# EAGLE design DMX_Dimmer (EAGLE 5.06)
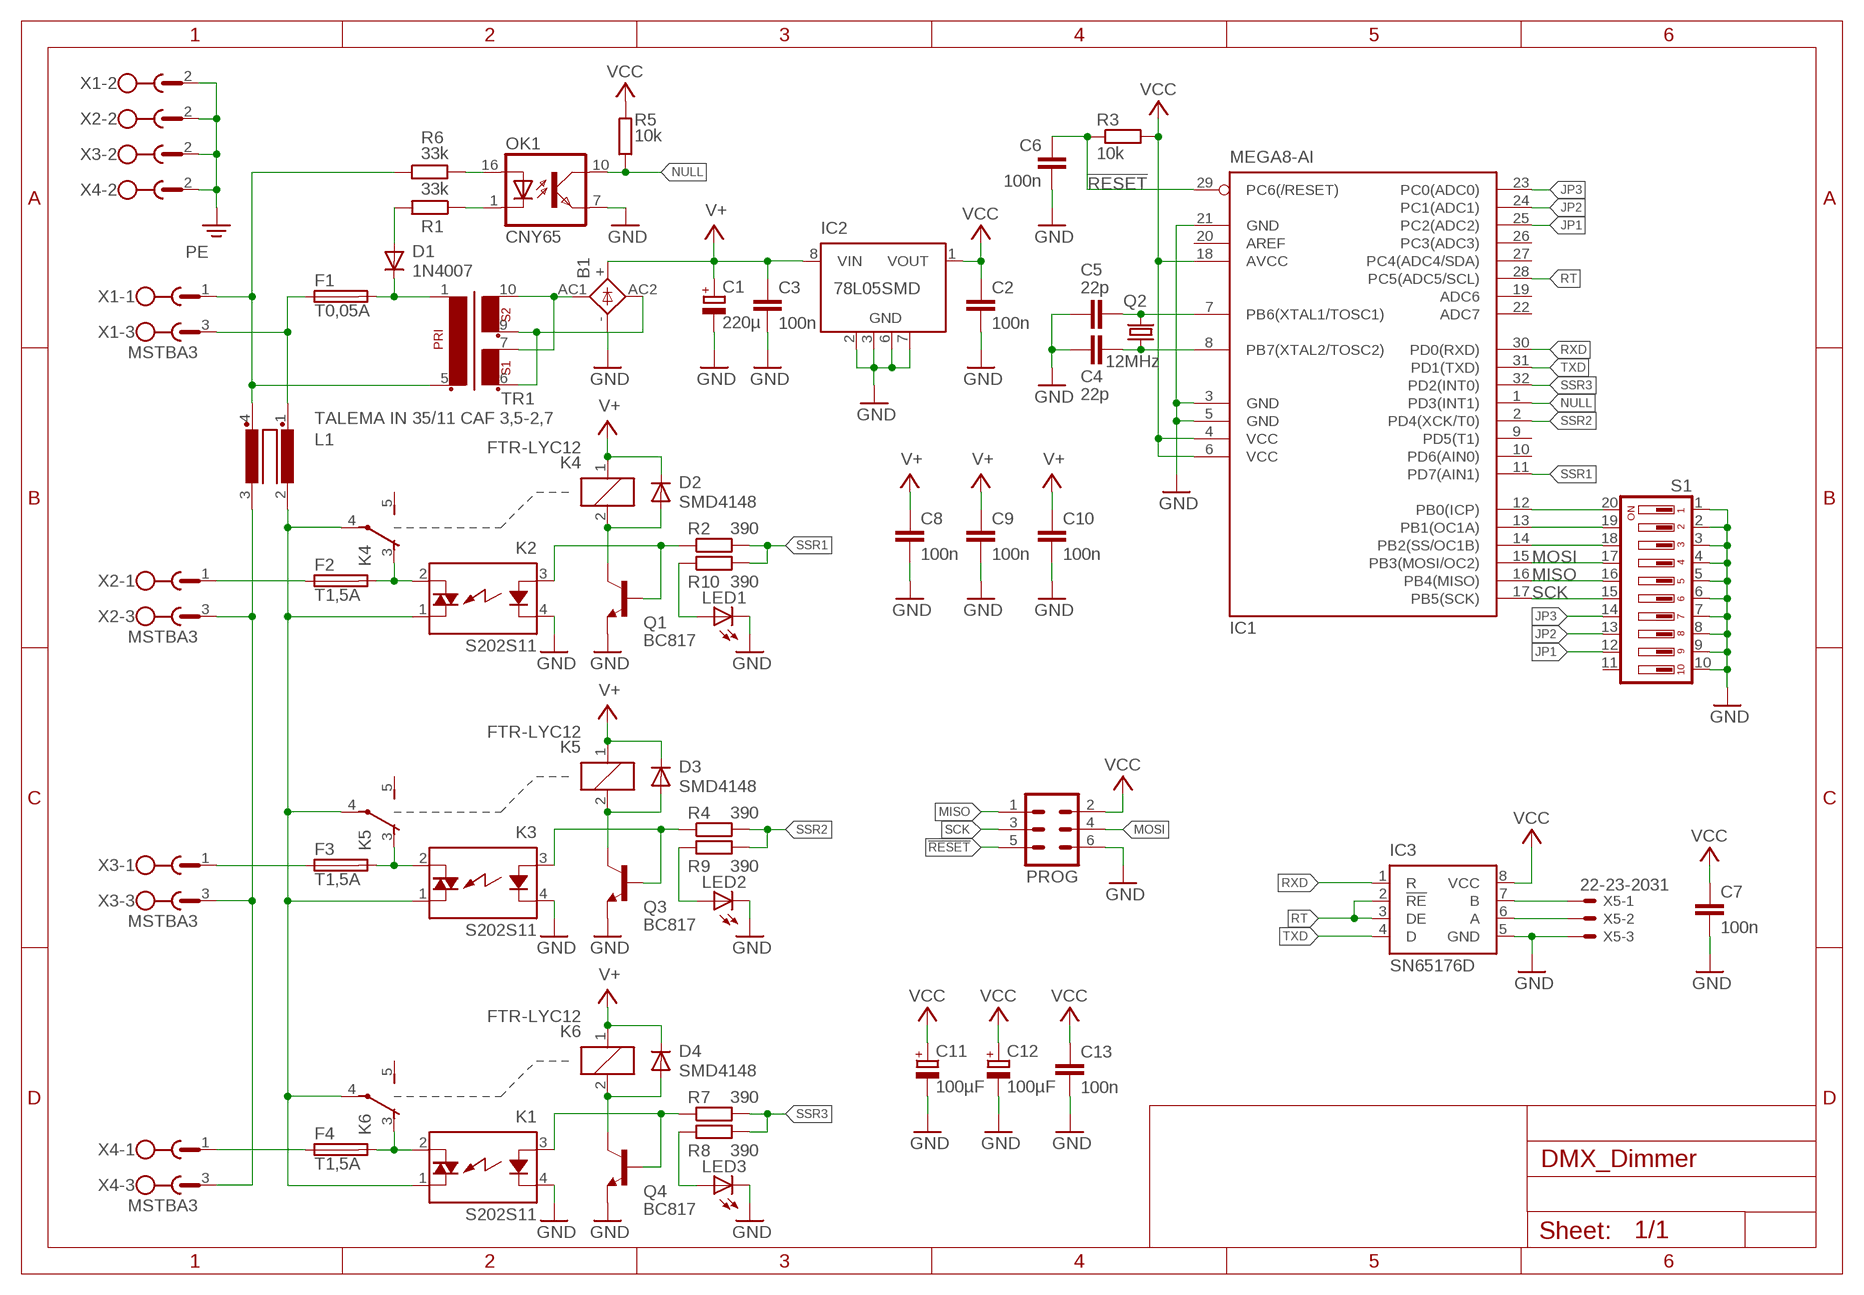
[diagram p0: schematic, sheet 1]

## Parts
B1  2KBB-R  [2KBB-R]
C1  220µ  CPOL-EUE5-8.5  [E5-8,5]
C2  100n  C-EUC0805K  [C0805K]
C3  100n  C-EUC0805K  [C0805K]
C4  22p  C-EUC0805K  [C0805K]
C5  22p  C-EUC0805K  [C0805K]
C6  100n  C-EUC0805K  [C0805K]
C7  100n  C-EUC0805K  [C0805K]
C8  100n  C-EUC0805K  [C0805K]
C9  100n  C-EUC0805K  [C0805K]
C10  100n  C-EUC0805K  [C0805K]
C11  100µF  CPOL-EUSMCD  [SMC_D]
C12  100µF  CPOL-EUSMCD  [SMC_D]
C13  100n  C-EUC0805K  [C0805K]
D1  1N4007  1N4004  [DO41-10]
D2  SMD4148  PMLL4150  [SOD80C]
D3  SMD4148  PMLL4150  [SOD80C]
D4  SMD4148  PMLL4150  [SOD80C]
F1  T0,05A  FUSESH22,5A  [SH22,5A]
F2  T1,5A  FUSESH22,5A  [SH22,5A]
F3  T1,5A  FUSESH22,5A  [SH22,5A]
F4  T1,5A  FUSESH22,5A  [SH22,5A]
IC1  MEGA8-AI  [TQFP32-08]
IC2  78L05SMD  [SO08]
IC3  SN65176D  [SO-08]
K1  S202S11  [S2XXEX]
K2  S202S11  [S2XXEX]
K3  S202S11  [S2XXEX]
K4  FTR-LYC12  [FTR-LYC]
K5  FTR-LYC12  [FTR-LYC]
K6  FTR-LYC12  [FTR-LYC]
L1  TALEMA IN 35/11 CAF 3,5-2,7  82723A  [82723A]
LED1  LEDCHIPLED_1206  [CHIPLED_1206]
LED2  LEDCHIPLED_1206  [CHIPLED_1206]
LED3  LEDCHIPLED_1206  [CHIPLED_1206]
OK1  CNY65  IL10  [DIL16-4_1_7_10_16]
PROG  ML6  [ML6]
Q1  BC817  BC817-16LT1SMD  [SOT23-BEC]
Q2  12MHz  CRYSTALCTS406  [CTS406]
Q3  BC817  BC817-16LT1SMD  [SOT23-BEC]
Q4  BC817  BC817-16LT1SMD  [SOT23-BEC]
R1  33k  R-EU_0207/10  [0207/10]
R2  390  R-EU_M0805  [M0805]
R3  10k  R-EU_R0805  [R0805]
R4  390  R-EU_M0805  [M0805]
R5  10k  R-EU_R0805  [R0805]
R6  33k  R-EU_0207/10  [0207/10]
R7  390  R-EU_M0805  [M0805]
R8  390  R-EU_M0805  [M0805]
R9  390  R-EU_M0805  [M0805]
R10  390  R-EU_M0805  [M0805]
S1  DP10  [DP-10]
TR1  EI30-2  [EI30-2]
X1  MSTBA3  [MSTBA3]
X2  MSTBA3  [MSTBA3]
X3  MSTBA3  [MSTBA3]
X4  MSTBA3  [MSTBA3]
X5  22-23-2031  [22-23-2031]

## Nets
!RESET: C6.1 IC1.29(PC6(/RESET)) PROG.5 R3.1
GND: B1.- C1.- C2.2 C3.2 C4.1 C5.1 C6.2 C7.2 C8.2 C9.2 C10.2 C11.- C12.- C13.2 IC1.3(GND) IC1.5(GND) IC1.21(GND) IC2.2(GND) IC2.3(GND) IC2.6(GND) IC2.7(GND) IC3.5(GND) K1.4(K) K2.4(K) K3.4(K) LED1.C LED2.C LED3.C OK1.7(EMIT) PROG.6 Q1.E Q3.E Q4.E S1.1 S1.2 S1.3 S1.4 S1.5 S1.6 S1.7 S1.8 S1.9 S1.10 X5.3
JP1: IC1.25(PC2(ADC2)) S1.12
JP2: IC1.24(PC1(ADC1)) S1.13
JP3: IC1.23(PC0(ADC0)) S1.14
MISO: IC1.16(PB4(MISO)) PROG.1 S1.16
MOSI: IC1.15(PB3(MOSI/OC2)) PROG.4 S1.17
N$1: D1.A R1.2
N$2: F2.2 K2.2(DS1) K4.3(-1:O)
N$3: LED3.A R8.1
N$4: F3.1 X3.1
N$5: D4.A K6.2 Q4.C
N$9: K1.1(DS2) K2.1(DS2) K3.1(DS2) K4.4(-1:P) K5.4(-1:P) K6.4(-1:P) L1.2
N$10: IC1.12(PB0(ICP)) S1.20
N$11: L1.4 R6.1 TR1.5 X1.1
N$12: F3.2 K3.2(DS1) K5.3(-1:O)
N$13: LED1.A R10.1
N$14: B1.AC1 TR1.7 TR1.10
N$15: F2.1 X2.1
N$16: LED2.A R9.1
N$17: B1.AC2 TR1.6 TR1.9
N$19: IC1.14(PB2(SS/OC1B)) S1.18
N$20: IC1.13(PB1(OC1A)) S1.19
N$21: F1.1 L1.1 X1.3
N$22: C5.2 IC1.7(PB6(XTAL1/TOSC1)) Q2.3
N$23: C4.2 IC1.8(PB7(XTAL2/TOSC2)) Q2.1
N$24: L1.3 X2.3 X3.3 X4.3
N$25: IC3.7(B) X5.1
N$27: IC3.6(A) X5.2
N$28: D1.C F1.2 TR1.1
N$29: D3.A K5.2 Q3.C
N$30: OK1.16(A) R6.2
N$31: K1.3(A) Q4.B R7.1
N$32: OK1.1(C) R1.1
N$33: F4.1 X4.1
N$34: K2.3(A) Q1.B R2.1
N$35: K3.3(A) Q3.B R4.1
N$36: F4.2 K1.2(DS1) K6.3(-1:O)
N$37: D2.A K4.2 Q1.C
NULL: IC1.1(PD3(INT1)) OK1.10(COL) R5.1
PE: X1.2 X2.2 X3.2 X4.2
RT: IC1.28(PC5(ADC5/SCL)) IC3.2(!RE) IC3.3(DE)
RXD: IC1.30(PD0(RXD)) IC3.1(R)
SCK: IC1.17(PB5(SCK)) PROG.3 S1.15
SSR1: IC1.11(PD7(AIN1)) R2.2 R10.2
SSR2: IC1.2(PD4(XCK/T0)) R4.2 R9.2
SSR3: IC1.32(PD2(INT0)) R7.2 R8.2
TXD: IC1.31(PD1(TXD)) IC3.4(D)
V+: B1.+ C1.+ C3.1 C8.1 C9.1 C10.1 D2.C D3.C D4.C IC2.8(VIN) K4.1 K5.1 K6.1
VCC: C2.1 C7.1 C11.+ C12.+ C13.1 IC1.4(VCC) IC1.6(VCC) IC1.18(AVCC) IC2.1(VOUT) IC3.8(VCC) PROG.2 R3.2 R5.2
Unconnected: IC1.9(PD5(T1)) IC1.10(PD6(AIN0)) IC1.19(ADC6) IC1.20(AREF) IC1.22(ADC7) IC1.26(PC3(ADC3)) IC1.27(PC4(ADC4/SDA)) IC2.4(NC) IC2.5(NC) K4.5(-1:S) K5.5(-1:S) K6.5(-1:S) S1.11

## Library data of the parts
B1 = rectifier:2KBB-R: RECTIFIER grid 3 x 5 mm
C1 C11 C12 = rcl:CPOL-EU: POLARIZED CAPACITOR, European symbol
C2-C10 C13 = rcl:C-EU: CAPACITOR, European symbol
D1 = diode:1N4004: DIODE general purpose rectifier, 1 A
D2-D4 = diode:PMLL4150: DIODE high speed
F1-F4 = fuse:FUSE: Fuse; OC_FARNELL: unknown; OC_NEWARK: unknown
IC1 = atmel:MEGA8: MICROCONTROLLER 8 Kbytes FLASH, 1 kbytes SRAM, 512 bytes EEPROM, USART, 6-channel 10 bit ADC, 2-channel 8 bit ADC Pin compatible with Atmega48, ATMega88, ATMega168 Source: avr.lbr
IC2 = linear:78L*SMD: Positive VOLTAGE REGULATOR
IC3 = texas:SN65176: DIFFERENTIAL BUS TRANSCEIVER Source: http://focus.ti.com .. sn65176b.pdf
K1-K3 = relay:S?*: Low Height Type Solid State Relays SHARP Source: 162574-da-01-en-S202T02_Solid_State_Relais.pdf Source: http://sharp-world.com .. s102s11_e.pdf; OC_FARNELL: unknown; OC_NEWARK: unknown
K4-K6 = relay:FTR-LYC: Schmales Netzrelais NETZRELAIS FTR-LYCA024V 1XUM 6A/250VAC Distributor: Conrad electronic Bestell Nr.: 504382 - 62 Source: http://www2.produktinfo.conrad.com/datenblaetter/500000-524999/504382-da-01-de-NETZRELAIS_FTR-LYCA024V_1XUM_6A_250VAC.pdf
L1 = inductors:82723A: FILTER
LED1-LED3 = led:LED: LED OSRAM: - CHIPLED LG R971, LG N971, LY N971, LG Q971, LY Q971, LO R971, LY R971 LH N974, LH R974 LS Q976, LO Q976, LY Q976 LO Q996 - Hyper CHIPLED LW Q18S LB Q993, LB Q99A, LB R99A - SideLED LS A670, LO A670, LY A670, LG A670, LP A670 LB A673, LV A673, LT A673, LW A673 LH A674 LY A675 LS A676, LA A676, LO A676, LY A676, LW A676 LS A679, LY A679, LG A679 - Hyper Micro SIDELED® LS Y876, LA Y876, LO Y876, LY Y876 LT Y87S - SmartLED LW L88C, LW L88S LB L89C, LB L89S, LG L890 LS L89K, LO L89K, LY L89K LS L896, LA L896, LO L896, LY L896 - TOPLED LS T670, LO T670, LY T670, LG T670, LP T670 LSG T670, LSP T670, LSY T670, LOP T670, LYG T670 LG T671, LOG T671, LSG T671 LB T673, LV T673, LT T673, LW T673 LH T674 LS T676, LA T676, LO T676, LY T676, LB T676, LH T676, LSB T676, LW T676 LB T67C, LV T67C, LT T67C, LS T67K, LO T67K, LY T67K, LW E67C LS E67B, LA E67B, LO E67B, LY E67B, LB E67C, LV E67C, LT E67C LW T67C LS T679, LY T679, LG T679 LS T770, LO T770, LY T770, LG T770, LP T770 LB T773, LV T773, LT T773, LW T773 LH T774 LS E675, LA E675, LY E675, LS T675 LS T776, LA T776, LO T776, LY T776, LB T776 LHGB T686 LT T68C, LB T68C - Hyper Mini TOPLED® LB M676 - Mini TOPLED Santana® LG M470 LS M47K, LO M47K, LY M47K Source: http://www.osram.convergy.de LUXEON: - LUMILED® LXK2-PW12-R00, LXK2-PW12-S00, LXK2-PW14-U00, LXK2-PW14-V00 LXK2-PM12-R00, LXK2-PM12-S00, LXK2-PM14-U00 LXK2-PE12-Q00, LXK2-PE12-R00, LXK2-PE12-S00, LXK2-PE14-T00, LXK2-PE14-U00 LXK2-PB12-K00, LXK2-PB12-L00, LXK2-PB12-M00, LXK2-PB14-N00, LXK2-PB14-P00, LXK2-PB14-Q00 LXK2-PR12-L00, LXK2-PR12-M00, LXK2-PR14-Q00, LXK2-PR14-R00 LXK2-PD12-Q00, LXK2-PD12-R00, LXK2-PD12-S00 LXK2-PH12-R00, LXK2-PH12-S00 LXK2-PL12-P00, LXK2-PL12-Q00, LXK2-PL12-R00 Source: www.luxeon.com KINGBRIGHT: KA-3528ASYC Source: www.kingbright.com
OK1 = optocoupler:IL10: SIEMENS OPTO COUPLER; OC_FARNELL: unknown; OC_NEWARK: unknown
PROG = con-harting-ml:ML6: HARTING; OC_FARNELL: unknown; OC_NEWARK: unknown
Q1 Q3 Q4 = transistor-npn:BC817*: NPN Transistor
Q2 = crystal:CRYSTAL: CRYSTAL
R1-R10 = rcl:R-EU_: RESISTOR, European symbol
S1 = switch-dil:DP10: DIL/CODE SWITCH
TR1 = trafo:EI30-2: TRANSFORMER 1 primary winding, 2 secondary windings ERA
X1-X4 = con-phoenix-508:MSTBA3: PHOENIX; MF: FARNELL; MPN: 1757255; OC_FARNELL: 3705183; OC_NEWARK: 71C4162
X5 = con-molex:22-23-2031: .100" (2.54mm) Center Header - 3 Pin; MF: MOLEX; MPN: 22-23-2031; OC_FARNELL: 1462950; OC_NEWARK: 30C0862

## Board
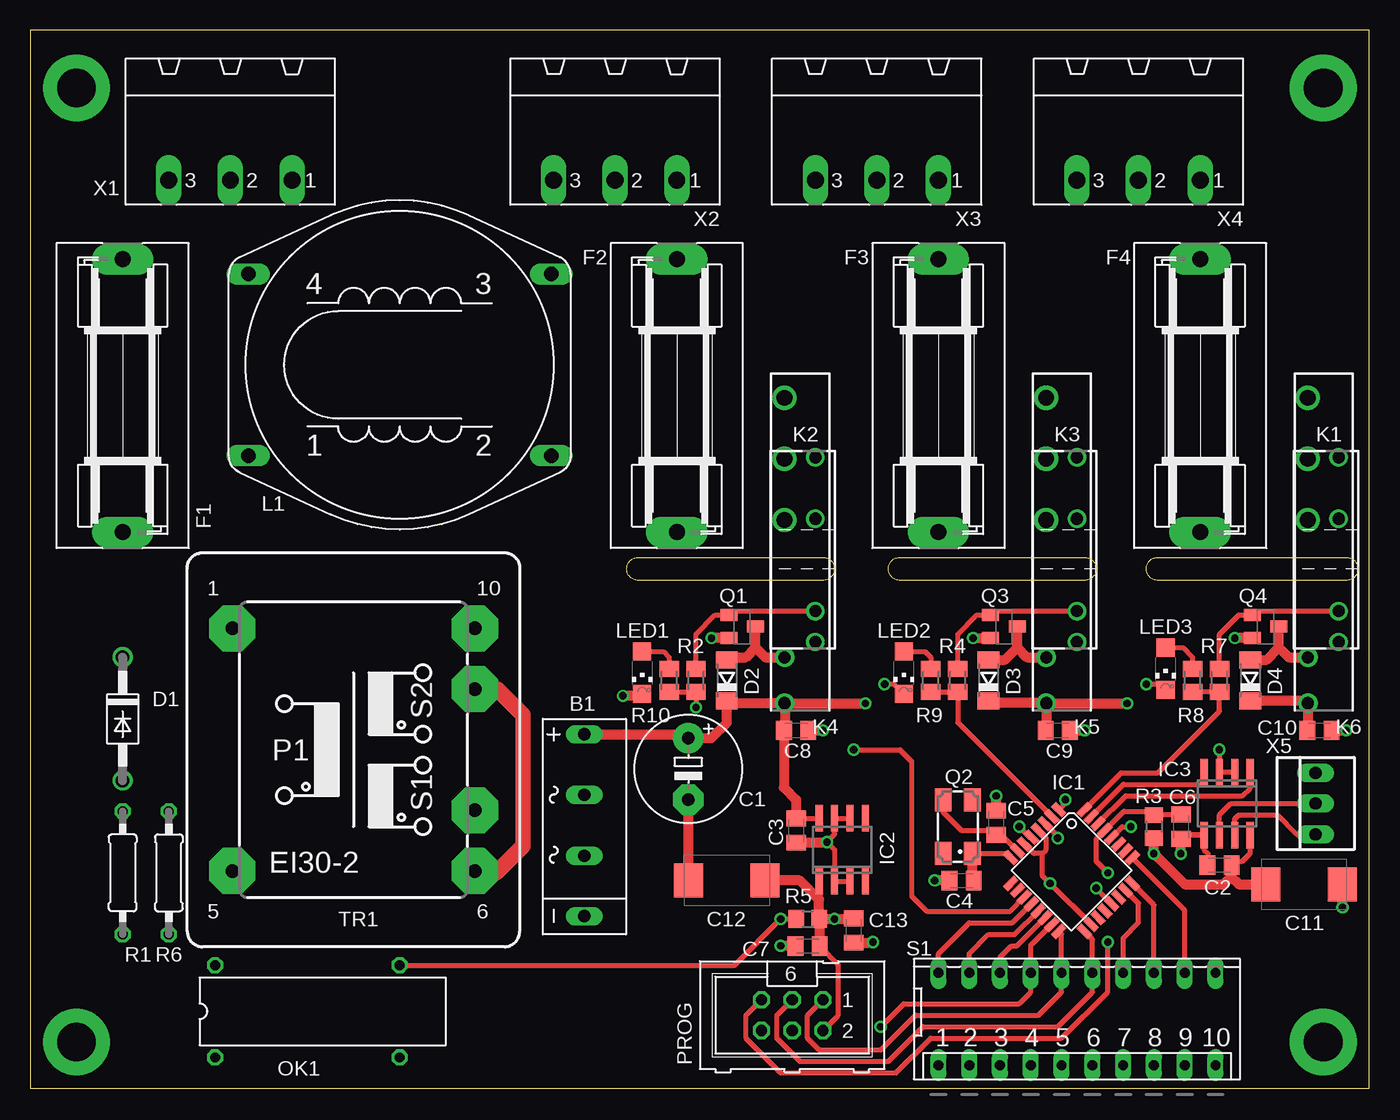
[diagram p1: board, top side]
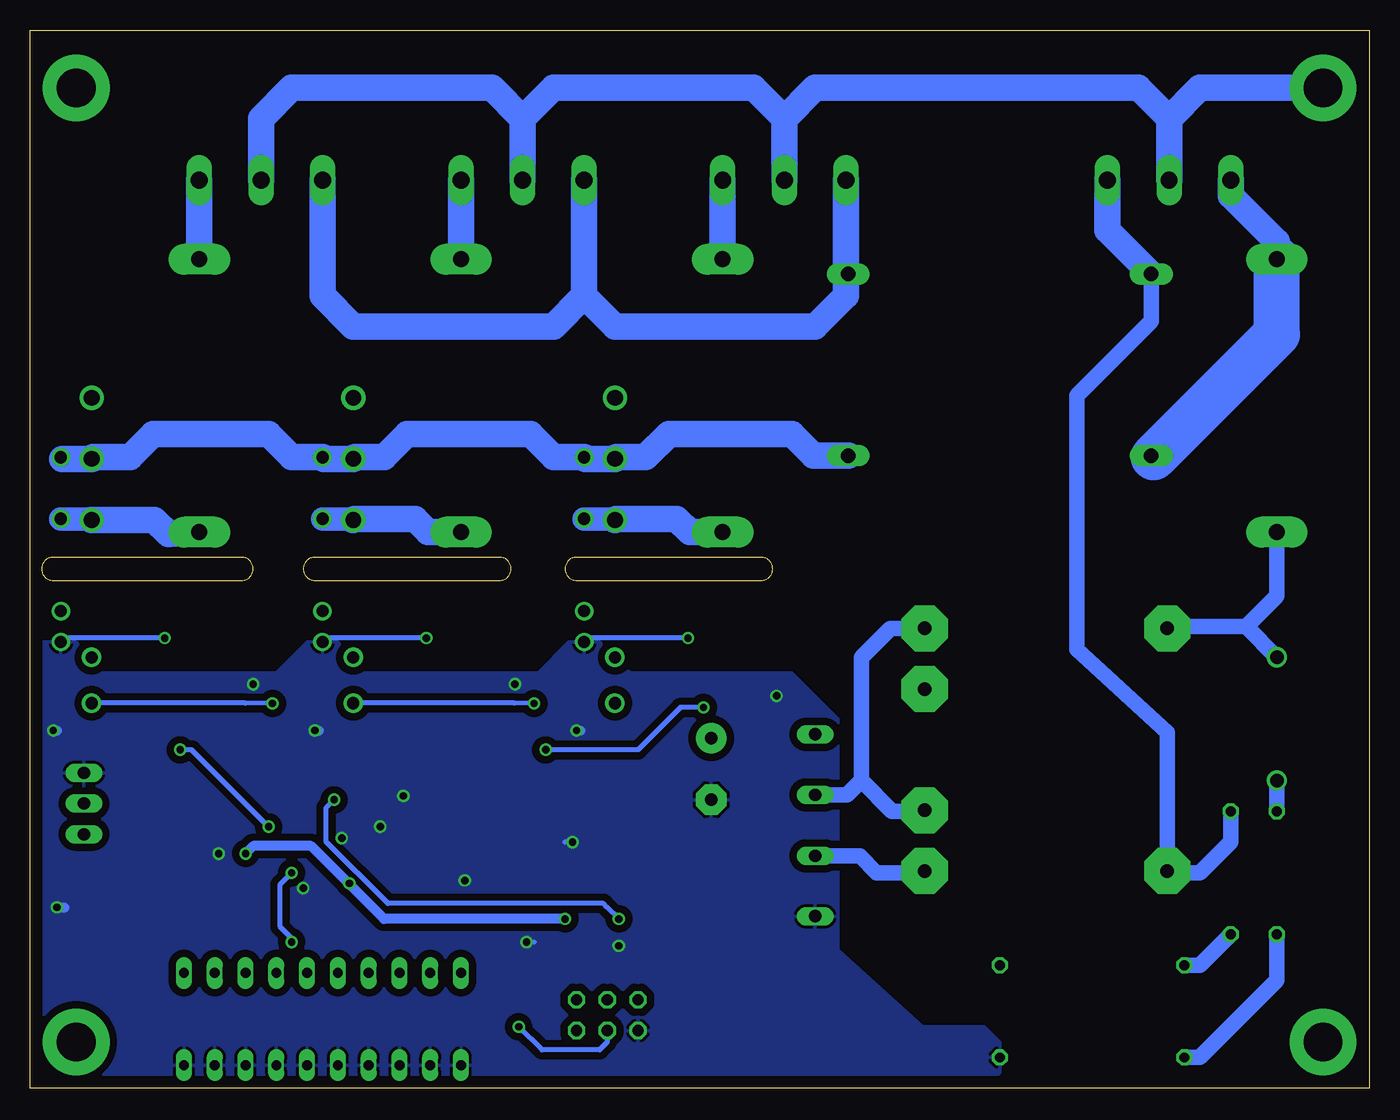
[diagram p2: board, bottom side, seen from below]

Size 110.47 x 87.3 mm. Coordinates in mm from the lower left corner, seen from the top.
Outline: 0,0 110.47,0 110.47,87.3 0,87.3 0,0
Outline: 65.41,41.91 50.16,41.91 arc-180 50.16,43.81 65.41,43.81 arc-180 65.41,41.91
Outline: 87,41.91 71.75,41.91 arc-180 71.75,43.81 87,43.81 arc-180 87,41.91
Outline: 108.58,41.91 93.03,41.91 arc-180 93.03,43.81 108.58,43.81 arc-180 108.58,41.91
Copper layers (1*16): Top 0.035mm / dielectric 1.5mm / Bottom 0.035mm
Design rules "default": minimum track width 10mil, minimum drill 24mil, track to track 8mil, track to pad 8mil, pad to pad 8mil, via to via 8mil, smd to smd 8mil, copper to edge 40mil, drill to drill 8mil, minimum pad ring 10mil, minimum via ring 8mil, stop-mask expansion 4mil, vias tented up to drill 0mil, thermal gap 10mil

### Footprints (pad centres in the part's own frame; a part is rotated, then mirrored left to right if it is on the bottom)
2KBB-R = drill 1.016 long: + -7.62,0; - 7.391,0; AC1 -2.616,0; AC2 2.413,0
E5-8,5 = drill 1.016 pad 2.54 round: + -2.54,0 | drill 1.016 pad 2.54 octagon: - 2.54,0
C0805K = smd 1.3 x 1.6: 1 -1,0; 2 1,0
SMC_D = smd 2.4 x 2.8: + -3.15,0; - 3.15,0
DO41-10 = drill 1.118 round: A 5.08,0; C -5.08,0
SOD80C = smd 1.4 x 1.8: A 1.7,0; C -1.7,0
SH22,5A = drill 1.321 pad 2.54 long: 1 -11.252,0; 2 11.252,0
TQFP32-08 = smd 1.27 x 0.559: 1 -4.293,2.8; 2 -4.293,2; 3 -4.293,1.2; 4 -4.293,0.4; 5 -4.293,-0.4; 6 -4.293,-1.2; 7 -4.293,-2; 8 -4.293,-2.8; 17 4.293,-2.8; 18 4.293,-2; 19 4.293,-1.2; 20 4.293,-0.4; 21 4.293,0.4; 22 4.293,1.2; 23 4.293,2; 24 4.293,2.8 | smd 0.559 x 1.27: 9 -2.8,-4.293; 10 -2,-4.293; 11 -1.2,-4.293; 12 -0.4,-4.293; 13 0.4,-4.293; 14 1.2,-4.293; 15 2,-4.293; 16 2.8,-4.293; 25 2.8,4.293; 26 2,4.293; 27 1.2,4.293; 28 0.4,4.293; 29 -0.4,4.293; 30 -1.2,4.293; 31 -2,4.293; 32 -2.8,4.293
SO08 = smd 0.6 x 2.2: 1 -1.905,-2.6; 2 -0.635,-2.6; 3 0.635,-2.6; 4 1.905,-2.6; 5 1.905,2.6; 6 0.635,2.6; 7 -0.635,2.6; 8 -1.905,2.6
SO-08 = smd 0.6 x 2.2: 1 -1.905,-2.6; 2 -0.635,-2.6; 3 0.635,-2.6; 4 1.905,-2.6; 5 1.905,2.6; 6 0.635,2.6; 7 -0.635,2.6; 8 -1.905,2.6
S2XXEX = drill 1 round: 1 -7.62,0; 2 -2.54,0; 3 5.08,0; 4 7.62,0
FTR-LYC = drill 1 pad 1.6 round: 1 -3.78,0; 2 0,0 | drill 1.3 pad 2 round: 3 11.34,0; 4 16.38,0; 5 21.42,0
82723A = drill 1.194 long: 1 12.497,7.493; 2 -12.497,7.493; 3 -12.497,-7.493; 4 12.497,-7.493
CHIPLED_1206 = smd 1.5 x 1.5: A 0,-1.75; C 0,1.75
DIL16-4_1_7_10_16 = drill 0.813 octagon: 1 -7.62,-3.81; 7 7.62,-3.81; 10 7.62,3.81; 16 -7.62,3.81
ML6 = drill 0.914 octagon: 1 -2.54,-1.27; 2 -2.54,1.27; 3 0,-1.27; 4 0,1.27; 5 2.54,-1.27; 6 2.54,1.27
SOT23-BEC = smd 1 x 1.4: B -0.95,-1.1; C 0,1.1; E 0.95,-1.1
CTS406 = smd 1.9 x 1.4: 1 -2.2,-1.2; 2 2.2,-1.2; 3 2.2,1.2; 4 -2.2,1.2
0207/10 = drill 0.813 octagon: 1 -5.08,0; 2 5.08,0
M0805 = smd 1.3 x 1.6: 1 -0.95,0; 2 0.95,0
R0805 = smd 1.3 x 1.5: 1 -0.95,0; 2 0.95,0
DP-10 = drill 0.813 long: 1 -11.43,-3.81; 2 -8.89,-3.81; 3 -6.35,-3.81; 4 -3.81,-3.81; 5 -1.27,-3.81; 6 1.27,-3.81; 7 3.81,-3.81; 8 6.35,-3.81; 9 8.89,-3.81; 10 11.43,-3.81; 11 11.43,3.81; 12 8.89,3.81; 13 6.35,3.81; 14 3.81,3.81; 15 1.27,3.81; 16 -1.27,3.81; 17 -3.81,3.81; 18 -6.35,3.81; 19 -8.89,3.81; 20 -11.43,3.81
EI30-2 = drill 1.118 pad 3.81 octagon: 1 -10.008,10.008; 5 -10.008,-10.008; 6 10.008,-10.008; 7 10.008,-5.004; 9 10.008,5.004; 10 10.008,10.008
MSTBA3 = drill 1.397 long: 1 -5.08,5.08; 2 0,5.08; 3 5.08,5.08
22-23-2031 = drill 1 long: 1 -2.54,0; 2 0,0; 3 2.54,0

### Placement (x,y rotation side)
B1  45.72,21.59 270 top
C1  54.29,26.35 270 top
C2  98.11,18.41 180 top
C3  63.18,21.27 270 top
C4  76.83,17.14 0 top
C5  79.69,21.91 270 top
C6  94.93,21.59 270 top
C7  64.14,11.75 180 top
C8  63.18,29.53 0 top
C9  84.77,29.53 0 top
C10  106.36,29.53 0 top
C11  105.09,16.83 0 top
C12  57.47,17.14 180 top
C13  67.94,13.02 270 top
D1  7.62,30.48 270 top
D2  57.47,33.66 90 top
D3  79.06,33.66 90 top
D4  100.65,33.66 90 top
F1  7.62,57.15 270 top
F2  53.34,57.15 270 top
F3  74.93,57.15 270 top
F4  96.52,57.15 270 top
IC1  85.91,17.97 315 top
IC2  66.99,19.68 0 top
IC3  98.74,23.5 180 top
K1  107.95,44.45 270 top
K2  64.77,44.45 270 top
K3  86.36,44.45 270 top
K4  62.23,35.56 90 top
K5  83.82,35.56 90 top
K6  105.41,35.56 90 top
L1  30.48,59.69 180 top
LED1  50.48,34.29 180 top
LED2  72.07,34.29 180 top
LED3  93.66,34.61 180 top
OK1  22.86,6.35 0 top
PROG  62.87,6.03 180 top
Q1  58.74,38.1 270 top
Q2  76.52,21.59 90 top
Q3  80.33,38.1 270 top
Q4  101.92,38.1 270 top
R1  7.62,17.78 90 top
R2  54.93,33.66 270 top
R3  92.71,21.59 270 top
R4  76.52,33.66 270 top
R5  64.14,13.97 0 top
R6  11.43,17.78 270 top
R7  98.11,33.66 270 top
R8  95.89,33.66 270 top
R9  74.3,33.66 270 top
R10  52.7,33.66 270 top
S1  86.36,5.71 0 top
TR1  26.67,27.94 0 top
X1  16.51,80.01 180 top
X2  48.26,80.01 180 top
X3  69.85,80.01 180 top
X4  91.44,80.01 180 top
X5  106.05,23.5 90 top

### Tracks (layer width: path | path; a pad name or v marks a point on that pad's centre or on a via)
!RESET  (via drill 0.6)
  Top 0.406: PROG.5 59.05,6.03 59.05,4.13 61.91,1.27 71.44,1.27 74.3,4.13 85.09,4.13 88.9,7.94 v88.9,12.06 | v88.9,17.78 87.95,18.73 87.95,20.57 IC1.29 90.24,22.86 92.39,22.86 R3.1 92.76,22.54 92.81,22.59 C6.1
  Bottom 0.406: v88.9,17.78 89.85,16.83 89.85,13.34 88.9,12.38 v88.9,12.06
GND  (via drill 0.6)
  Top 0.406: v77.79,37.15 | v56.2,37.15 | v99.38,37.15 | IC1.21 88.27,16.18 v87.95,16.51 | IC1.3 84.77,20.8 v84.77,20.64 | C6.2 95.24,20.89 IC3.5 | IC3.5 96.84,19.68 97.16,19.37 97.16,18.68 C2.2 | IC3.5 95.19,20.89 94.93,20.64 | IC1.5 82.47,20.72 v81.6,21.59 | LED1.C 50.48,32.38 | IC2.6 IC2.7 66.36,20.95 v65.72,20.32 | IC2.3 IC2.2 66.36,19.68 v65.72,20.32 | 65.67,20.27 v65.72,20.32 | v70.48,33.34 71.28,33.34 LED2.C | v92.08,33.34 93.18,33.34 LED3.C
  Top 0.813: v77.79,37.15 Q3.E | Q1.E v56.2,37.15 | Q4.E v99.38,37.15 | C4.1 v74.61,17.14 | v94.93,19.37 94.93,20.64 | C7.2 v61.91,11.75 | C5.1 v79.69,24.13 | C10.2 v108.58,29.53 | C9.2 v87,29.53 | C8.2 v65.41,29.53 | 50.48,32.38 v48.9,32.38 | C3.2 65.67,20.27 | C11.- 108.24,14.95 v108.27,14.92 | C1.- 54.29,17.17 C12.- | C13.2 69.17,12.02 v69.53,12.06
  Bottom 0.406: v77.79,37.15 86.04,37.15 K3.4 | v56.2,37.15 64.45,37.15 K2.4 | v99.38,37.15 107.63,37.15 K1.4 | v84.77,20.64 84.77,20.32 | v94.93,19.37 95.25,19.37 | v79.69,24.13 79.38,24.13 | v81.6,21.59 81.6,21.91 | v48.9,32.38 49.21,32.38 | v70.48,33.34 70.8,33.34 | v92.08,33.34 92.39,33.34 | v65.72,20.32 66.36,20.32 | v69.53,12.06 68.9,12.06
  Bottom 0.813: v108.58,29.53 108.27,29.53 | v87,29.53 86.68,29.53 | v65.41,29.53 65.09,29.53 | v108.27,14.92 107.63,14.92
  pour Bottom (isolate 0.61): 43.81,30.48 47.62,34.29 60.96,34.29 63.5,36.83 66.04,36.83 68.58,34.29 83.19,34.29 85.09,36.83 87.63,36.83 90.17,34.29 104.46,34.29 106.68,36.83 110.49,36.83 110.49,0 31.75,0 30.48,1.27 30.48,3.81 31.75,5.08 36.83,5.08 43.81,11.43
JP1
  Top 0.406: IC1.25 95.25,14.7 S1.12
JP2
  Top 0.406: IC1.24 92.71,15.13 S1.13
JP3
  Top 0.406: IC1.23 91.44,15.27 91.44,13.65 90.17,12.38 S1.14
MISO
  Top 0.406: IC1.16 85.09,12.72 S1.16 85.09,7.94 83.19,6.03 73.03,6.03 70.17,3.17 65.09,3.17 64.14,4.13 64.14,6.03 PROG.1
MOSI  (via drill 0.6)
  Top 0.406: IC1.15 82.55,11.78 S1.17 82.55,7.94 81.6,6.99 72.07,6.99 v70.17,5.08
  Bottom 0.406: v70.17,5.08 68.26,3.17 63.5,3.17 62.87,3.81 PROG.4
N$1
  Bottom 1.27: R1.2 D1.A
N$2
  Bottom 1.93: 57.15,46.99 K2.2
  Bottom 2.184: F2.2 56.06,45.9 57.15,46.99 62.14,46.99 K4.3
N$3
  Top 0.406: LED3.A 95.09,36.36 95.89,35.56 R8.1
N$4
  Bottom 2.184: F3.1 X3.1
N$5
  Top 0.813: 103.02,36.37 Q4.C | 103.02,36.37 103.82,35.56 K6.2 | D4.A 102.01,35.35 103.02,36.37
N$6  (via drill 3.2 pad 5.5)
  other vias: 3.81,3.81
N$7  (via drill 3.2 pad 5.5)
  other vias: 106.68,3.81
N$8  (via drill 3.2 pad 5.5)
  other vias: 106.68,82.55
N$9
  Bottom 1.27: 62.1,52.07 K4.4 | 64.64,51.94 K2.1 | 83.69,52.07 K5.4 | 86.23,51.94 K3.1 | 105.28,52.07 K6.4 | 107.82,51.94 K1.1
  Bottom 2.184: L1.2 45.85,52.2 47.62,53.98 57.78,53.98 59.69,52.07 62.1,52.07 | K4.4 64.64,51.94 | K2.1 67.31,52.07 69.22,53.98 79.38,53.98 81.28,52.07 83.69,52.07 | K5.4 86.23,51.94 | K3.1 88.9,52.07 90.81,53.98 100.33,53.98 102.23,52.07 105.28,52.07 | K6.4 107.82,51.94
N$10
  Top 0.406: IC1.12 81.03,13.65 77.47,13.65 74.93,11.11 S1.20
N$11
  Bottom 0.406: 16.51,17.78 TR1.5
  Bottom 1.27: L1.4 17.98,63.3 24.13,57.15 24.13,36.2 16.66,29.36 TR1.5 | R6.1 11.43,20.32 13.97,17.78 16.51,17.78
  Bottom 2.184: X1.1 21.59,70.79 L1.4
N$12
  Bottom 1.93: 78.74,46.99 K3.2
  Bottom 2.184: F3.2 77.65,45.9 78.74,46.99 83.73,46.99 K5.3
N$13
  Top 0.406: LED1.A 52.23,36.04 52.7,35.56 R10.1
N$14
  Bottom 1.27: TR1.10 39.52,37.95 41.91,35.56 41.91,25.4 | 41.91,25.4 39.37,22.86 36.75,22.86 TR1.7 | B1.AC1 43.1,24.21 41.91,25.4
N$15
  Bottom 2.184: F2.1 X2.1
N$16
  Top 0.406: LED2.A 73.81,36.04 74.3,35.56 R9.1
N$17
  Top 0.406: TR1.6 36.83,17.78
  Top 1.27: TR1.9 38.49,32.94 40.64,30.8 40.64,20 38.42,17.78 36.83,17.78
  Bottom 1.27: B1.AC2 42.04,19.18 40.64,17.78 36.83,17.78 TR1.6
N$19
  Top 0.406: IC1.14 81.39,11.75 80.96,11.75 80.01,10.79 S1.18
N$20
  Top 0.406: IC1.13 81.21,12.7 79.06,12.7 77.47,11.11 S1.19
N$21
  Bottom 1.27: 17.78,52.07 17.86,52.07 L1.1
  Bottom 2.184: X1.3 11.43,73.66 7.62,69.85 F1.1
  Bottom 3.81: F1.1 7.62,62.23 17.78,52.07
N$22
  Top 0.406: IC1.7 80.14,20.91 C5.2 79.33,21.27 76.83,21.27 75.32,22.79 Q2.3
N$23
  Top 0.406: C4.2 77.72,17.26 | IC1.8 80.53,19.39 Q2.1
  Top 0.813: 77.72,17.26 Q2.1
N$24
  Bottom 2.184: L1.3 43.18,67.39 X2.3 43.18,65.41 45.72,62.87 62.23,62.87 64.77,65.41 | 64.77,65.41 X3.3 | 64.77,65.41 67.31,62.87 83.82,62.87 86.36,65.41 X4.3
N$25
  Top 0.406: X5.1 104.46,20.95 102.87,22.54 99.69,22.54 99.38,22.23 IC3.7
N$27
  Top 0.406: X5.2 99.06,23.5 98.11,22.54 IC3.6
N$28
  Bottom 1.27: 10.16,38.1 16.51,38.1 TR1.1 | F1.2 7.62,40.64 10.16,38.1 | D1.C 10.16,38.1
N$29
  Top 0.813: 81.43,36.37 Q3.C | 81.43,36.37 82.23,35.56 K5.2 | D3.A 80.42,35.35 81.43,36.37
N$30
  Bottom 1.27: R6.2 13.97,10.16 OK1.16
N$31
  Top 0.406: K1.3 100.82,39.37 Q4.B 99.69,39.05 98.11,37.47 R7.1
N$32
  Bottom 1.27: R1.1 7.62,8.89 13.97,2.54 OK1.1
N$33
  Bottom 2.184: F4.1 X4.1
N$34
  Top 0.406: K2.3 58.27,39.37 Q1.B 56.51,39.05 54.93,37.47 R2.1
N$35
  Top 0.406: K3.3 79.23,39.37 Q3.B 78.1,39.05 78.11,39.05 76.52,37.47 R4.1
N$36
  Bottom 1.93: F4.2 99.24,45.9 100.33,46.99 K1.2
  Bottom 2.184: F4.2 99.06,45.72 100.24,46.9 K6.3
N$37
  Top 0.406: D2.A 58.31,35.56
  Top 0.813: 59.84,36.37 Q1.C | 59.84,36.37 60.64,35.56 K4.2 | 58.31,35.56 59.03,35.56 59.84,36.37
NULL  (via drill 0.6)
  Top 0.406: OK1.10 58.1,10.16 v61.91,13.97 | v61.91,13.97 R5.1 62.87,13.97 v61.91,13.97 | v85.41,23.81 85.41,23.53 IC1.1
  Bottom 0.406: v61.91,13.97 62.87,14.92 63.18,15.24 80.96,15.24 86.04,20.32 86.04,23.18 v85.41,23.81
PE  (via drill 3.2 pad 5.5)
  Bottom 2.184: 16.51,80.01 13.97,82.55 v3.81,82.55 | 16.51,80.01 X1.2 | 16.51,80.01 19.05,82.55 45.72,82.55 48.26,80.01 | 48.26,80.01 X2.2 | 48.26,80.01 50.8,82.55 67.31,82.55 69.85,80.01 | 69.85,80.01 X3.2 | 69.85,80.01 72.39,82.55 88.9,82.55 91.44,80.01 X4.2
RT  (via drill 0.6)
  Top 0.406: IC3.2 IC3.3 v98.11,27.94 | IC1.28 90.1,21.59 v90.81,21.59
  Bottom 0.406: v90.81,21.59 97.16,27.94 v98.11,27.94
RXD
  Top 0.406: IC3.1 100.65,24.77 100.01,24.13 90.38,24.13 IC1.30
SCK
  Top 0.406: IC1.17 87.63,12.29 S1.15 87.63,7.94 84.77,5.08 73.66,5.08 70.8,2.22 63.5,2.22 61.59,4.13 61.59,6.03 PROG.3
SSR1  (via drill 0.6)
  Top 0.406: IC1.11 80.85,14.61 73.98,14.61 72.71,15.88 72.71,26.99 71.75,27.94 v67.94,27.94 | v54.93,31.43 R2.2 R10.2
  Bottom 0.406: v67.94,27.94 60.33,27.94 56.83,31.43 v54.93,31.43
SSR2
  Top 0.406: IC1.2 76.52,30.19 R4.2 R9.2
SSR3
  Top 0.406: IC1.32 90.02,26.04 93.03,26.04 98.11,31.11 R7.2 R8.2
TXD
  Top 0.406: IC3.4 96.84,25.08 90.2,25.08 IC1.31
V+  (via drill 0.6)
  Top 0.406: K6.1 105.23,31.95 | K5.1 83.85,31.75 | K4.1 62.26,31.75 | 53.98,29.21 C1.+ | IC2.8 63.2,22.29 C3.1
  Top 0.813: 105.23,31.95 D4.C | v90.49,31.75 83.85,31.75 83.85,29.61 C9.1 | v68.9,31.75 62.26,31.75 62.26,29.61 C8.1 62.18,24.81 63.18,23.81 C3.1 | B1.+ 53.98,29.21 | C1.+ 56.2,28.89 57.47,30.16 57.47,31.43 | 57.47,31.43 D2.C | K5.1 79.23,31.78 D3.C | K4.1 57.81,31.78 57.47,31.43 | K6.1 105.41,29.57 C10.1
  Bottom 0.406: v90.49,31.75 92.74,31.78 K6.1 | v68.9,31.75 70.52,31.78 K5.1
VCC  (via drill 0.6)
  Top 0.406: IC1.6 82.81,19.37 83.5,19.37 | IC1.4 83.82,20.62 83.82,19.68 83.5,19.37 | IC1.18 v84.14,16.91 83.5,17.55 83.5,19.37 | R3.2 92.71,20.32 v92.71,19.37 | C7.1 66.67,10.21 66.67,6.03 PROG.2 | 65.14,13.92 R5.2 | IC3.8 100.65,19.37 100.01,18.73 99.42,18.73 C2.1 99.06,18.37 | 67.9,13.97 C13.1
  Top 0.61: 65.09,15.56 IC2.1
  Top 0.813: R3.2 v92.71,19.37 95.25,16.83 98.42,16.83 99.06,17.46 | 99.06,17.46 99.06,18.37 | C7.1 65.14,13.92 | R5.2 v66.36,13.97 67.9,13.97 | R5.2 65.09,15.56 63.5,17.14 C12.+ | 99.06,17.46 99.69,16.83 C11.+
  Bottom 0.254: 84.22,16.91 | 84.14,16.83 84.22,16.91
  Bottom 0.406: 84.22,16.91 v84.14,16.91
  Bottom 0.813: v92.71,19.37 92.08,20 87.31,20 84.22,16.91 | v66.36,13.97 81.28,13.97 84.14,16.83 84.18,16.87